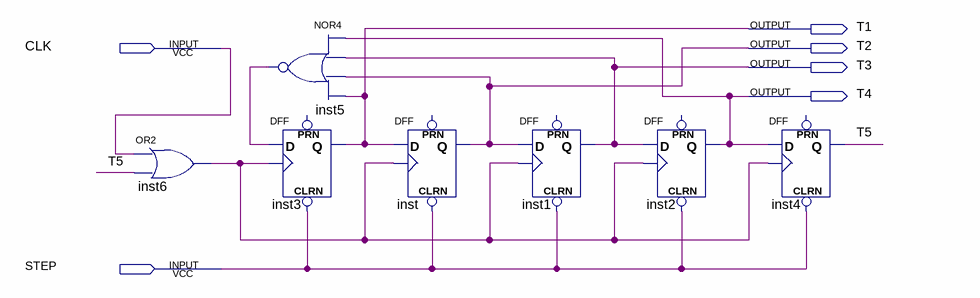
[diagram p0: schematic sheet]
// Quartus schematic Obeat.bdf as structural Verilog: 7 symbols, 6 pins
module Obeat (
  input  CLK,
  input  STEP,
  output T1,
  output T2,
  output T3,
  output T4
);

  wire inst5_out, inst6_out, T5;

  or inst6 (inst6_out, CLK, T5);
  nor inst5 (inst5_out, T4, T3, T2, T1);
  DFF inst3 (.CLRN(STEP), .CLK(inst6_out), .D(inst5_out), .Q(T1));  // open: PRN
  DFF inst (.CLRN(STEP), .CLK(inst6_out), .D(T1), .Q(T2));  // open: PRN
  DFF inst1 (.CLRN(STEP), .CLK(inst6_out), .D(T2), .Q(T3));  // open: PRN
  DFF inst2 (.CLRN(STEP), .CLK(inst6_out), .D(T3), .Q(T4));  // open: PRN
  DFF inst4 (.CLRN(STEP), .CLK(inst6_out), .D(T4), .Q(T5));  // open: PRN
endmodule
